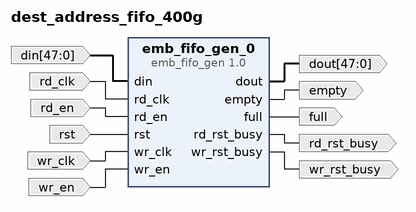
[diagram p0: block diagram of the top level]
# Vivado block design dest_address_fifo_400g, xcvp1802-lsvc4072-2MP-e-S, Vivado 2023.1
create_bd_design dest_address_fifo_400g

create_bd_port -dir I -from 47 -to 0 din
create_bd_port -dir O -from 47 -to 0 dout
create_bd_port -dir O empty
create_bd_port -dir O full
create_bd_port -dir I -type clk rd_clk
create_bd_port -dir I rd_en
create_bd_port -dir O rd_rst_busy
create_bd_port -dir I rst
create_bd_port -dir I -type clk wr_clk
create_bd_port -dir I wr_en
create_bd_port -dir O wr_rst_busy

create_bd_cell -type ip -vlnv xilinx.com:ip:emb_fifo_gen:1.0 emb_fifo_gen_0
set_property -dict [list \
  CONFIG.CLOCK_DOMAIN Independent_Clock \
  CONFIG.ENABLE_ALMOST_EMPTY false \
  CONFIG.ENABLE_ALMOST_FULL false \
  CONFIG.ENABLE_DATA_COUNT false \
  CONFIG.ENABLE_OVERFLOW false \
  CONFIG.ENABLE_PROGRAMMABLE_EMPTY false \
  CONFIG.ENABLE_PROGRAMMABLE_FULL false \
  CONFIG.ENABLE_READ_DATA_COUNT false \
  CONFIG.ENABLE_READ_DATA_VALID false \
  CONFIG.ENABLE_UNDERFLOW false \
  CONFIG.ENABLE_WRITE_ACK false \
  CONFIG.ENABLE_WRITE_DATA_COUNT false \
  CONFIG.FIFO_WRITE_DEPTH 16 \
  CONFIG.READ_MODE FWFT \
  CONFIG.WRITE_DATA_WIDTH 48 \
] [get_bd_cells emb_fifo_gen_0]

# ---- connections ----

connect_bd_net -net din_0_1 [get_bd_ports din] [get_bd_pins emb_fifo_gen_0/din]
connect_bd_net [get_bd_pins emb_fifo_gen_0/dout] [get_bd_ports dout]
connect_bd_net [get_bd_pins emb_fifo_gen_0/empty] [get_bd_ports empty]
connect_bd_net [get_bd_pins emb_fifo_gen_0/full] [get_bd_ports full]
connect_bd_net [get_bd_pins emb_fifo_gen_0/rd_rst_busy] [get_bd_ports rd_rst_busy]
connect_bd_net [get_bd_pins emb_fifo_gen_0/wr_rst_busy] [get_bd_ports wr_rst_busy]
connect_bd_net -net rd_clk_0_1 [get_bd_ports rd_clk] [get_bd_pins emb_fifo_gen_0/rd_clk]
connect_bd_net -net rd_en_0_1 [get_bd_ports rd_en] [get_bd_pins emb_fifo_gen_0/rd_en]
connect_bd_net -net rst_0_1 [get_bd_ports rst] [get_bd_pins emb_fifo_gen_0/rst]
connect_bd_net -net wr_clk_0_1 [get_bd_ports wr_clk] [get_bd_pins emb_fifo_gen_0/wr_clk]
connect_bd_net -net wr_en_0_1 [get_bd_ports wr_en] [get_bd_pins emb_fifo_gen_0/wr_en]

validate_bd_design
save_bd_design
